# EAGLE design Driver_Shield (EAGLE 5.06)
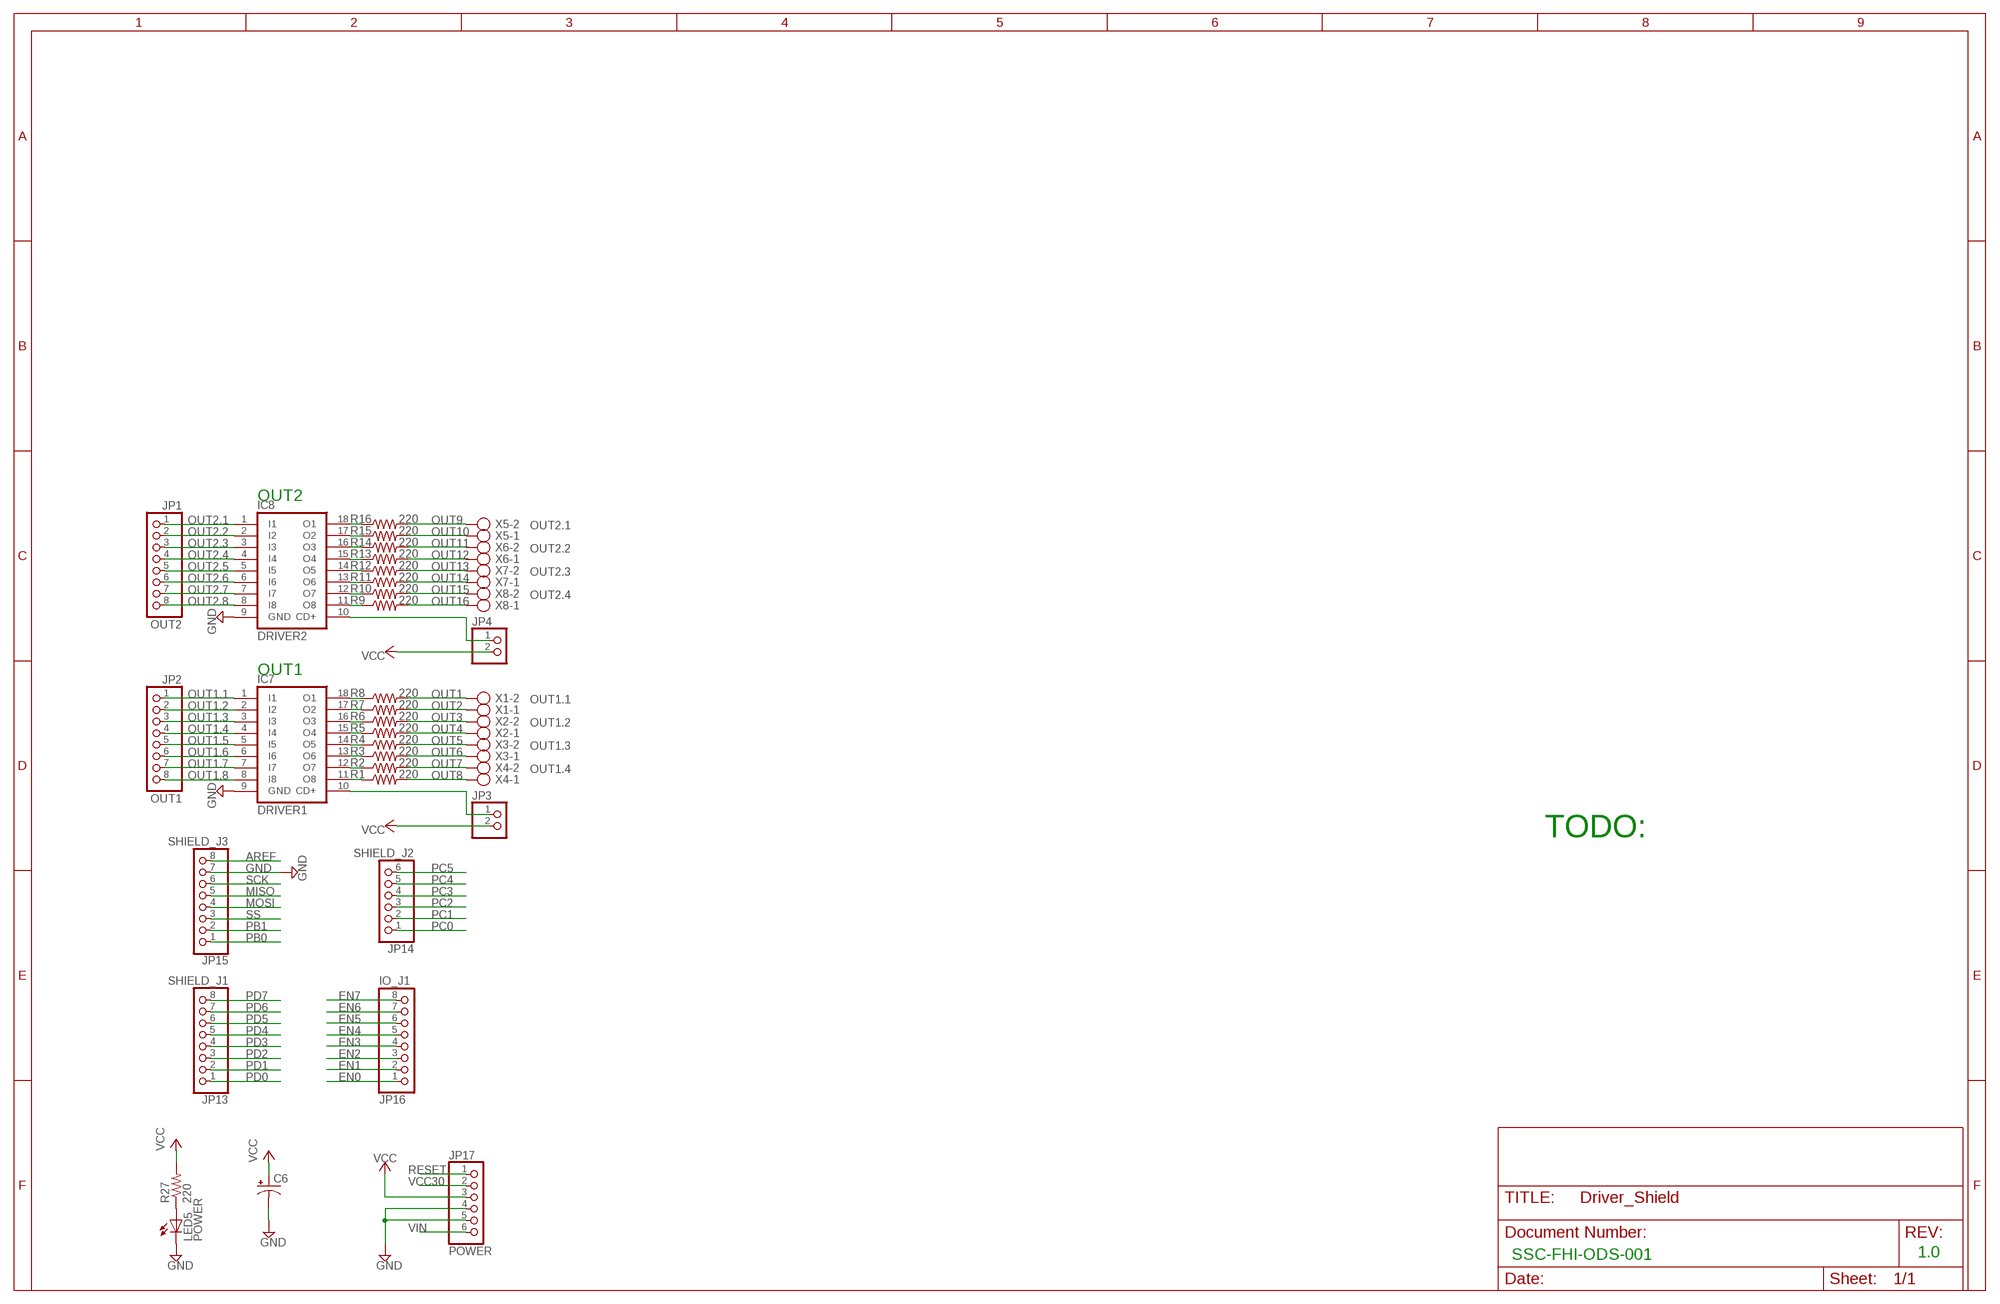
[diagram p0: schematic, sheet 1]

## Parts
C6  CPOL-USE2.5-5  [E2,5-5]
IC7  DRIVER1  ULN2803A  [DIL18]
IC8  DRIVER2  ULN2803A  [DIL18]
JP1  OUT2  PINHD-1X8  [1X08]
JP2  OUT1  PINHD-1X8  [1X08]
JP3  PINHD-1X2  [1X02]
JP4  PINHD-1X2  [1X02]
JP13  SHIELD_J1  PINHD-1X8  [1X08]
JP14  SHIELD_J2  PINHD-1X6  [1X06]
JP15  SHIELD_J3  PINHD-1X8  [1X08]
JP16  IO_J1  PINHD-1X8  [1X08]
JP17  POWER  PINHD-1X6  [1X06]
LED5  POWER  LED5MM  [LED5MM]
R1  220  R-US_0207/2V  [0207/2V]
R2  220  R-US_0207/2V  [0207/2V]
R3  220  R-US_0207/2V  [0207/2V]
R4  220  R-US_0207/2V  [0207/2V]
R5  220  R-US_0207/2V  [0207/2V]
R6  220  R-US_0207/2V  [0207/2V]
R7  220  R-US_0207/2V  [0207/2V]
R8  220  R-US_0207/2V  [0207/2V]
R9  220  R-US_0207/2V  [0207/2V]
R10  220  R-US_0207/2V  [0207/2V]
R11  220  R-US_0207/2V  [0207/2V]
R12  220  R-US_0207/2V  [0207/2V]
R13  220  R-US_0207/2V  [0207/2V]
R14  220  R-US_0207/2V  [0207/2V]
R15  220  R-US_0207/2V  [0207/2V]
R16  220  R-US_0207/2V  [0207/2V]
R27  220  R-US_0204/7  [0204/7]
X1  OUT1.1  AK550/2  [AK550/2]
X2  OUT1.2  AK550/2  [AK550/2]
X3  OUT1.3  AK550/2  [AK550/2]
X4  OUT1.4  AK550/2  [AK550/2]
X5  OUT2.1  AK550/2  [AK550/2]
X6  OUT2.2  AK550/2  [AK550/2]
X7  OUT2.3  AK550/2  [AK550/2]
X8  OUT2.4  AK550/2  [AK550/2]

## Nets
AREF: JP15.8
EN0: JP16.1
EN1: JP16.2
EN2: JP16.3
EN3: JP16.4
EN4: JP16.5
EN5: JP16.6
EN6: JP16.7
EN7: JP16.8
GND: C6.- IC7.9(GND) IC8.9(GND) JP15.7 JP17.4 JP17.5 LED5.K(C)
MISO: JP15.5
MOSI: JP15.4
N$4: IC7.12(O7) R2.1
N$12: IC7.18(O1) R8.1
N$13: IC7.17(O2) R7.1
N$14: IC7.16(O3) R6.1
N$15: IC7.15(O4) R5.1
N$17: IC8.12(O7) R10.1
N$21: IC7.14(O5) R4.1
N$30: IC7.13(O6) R3.1
N$32: IC7.11(O8) R1.1
N$39: LED5.A R27.1
N$61: IC8.18(O1) R16.1
N$62: IC8.17(O2) R15.1
N$63: IC8.16(O3) R14.1
N$64: IC8.15(O4) R13.1
N$65: IC8.14(O5) R12.1
N$66: IC8.13(O6) R11.1
N$68: IC8.11(O8) R9.1
OUT1: R8.2 X1.2
OUT1.1: IC7.1(I1) JP2.1
OUT1.2: IC7.2(I2) JP2.2
OUT1.3: IC7.3(I3) JP2.3
OUT1.4: IC7.4(I4) JP2.4
OUT1.5: IC7.5(I5) JP2.5
OUT1.6: IC7.6(I6) JP2.6
OUT1.7: IC7.7(I7) JP2.7
OUT1.8: IC7.8(I8) JP2.8
OUT1_FCB: IC7.10(CD+) JP3.1
OUT2: R7.2 X1.1
OUT2.1: IC8.1(I1) JP1.1
OUT2.2: IC8.2(I2) JP1.2
OUT2.3: IC8.3(I3) JP1.3
OUT2.4: IC8.4(I4) JP1.4
OUT2.5: IC8.5(I5) JP1.5
OUT2.6: IC8.6(I6) JP1.6
OUT2.7: IC8.7(I7) JP1.7
OUT2.8: IC8.8(I8) JP1.8
OUT2_FCB: IC8.10(CD+) JP4.1
OUT3: R6.2 X2.2
OUT4: R5.2 X2.1
OUT5: R4.2 X3.2
OUT6: R3.2 X3.1
OUT7: R2.2 X4.2
OUT8: R1.2 X4.1
OUT9: R16.2 X5.2
OUT10: R15.2 X5.1
OUT11: R14.2 X6.2
OUT12: R13.2 X6.1
OUT13: R12.2 X7.2
OUT14: R11.2 X7.1
OUT15: R10.2 X8.2
OUT16: R9.2 X8.1
PB0: JP15.1
PB1: JP15.2
PC0: JP14.1
PC1: JP14.2
PC2: JP14.3
PC3: JP14.4
PC4: JP14.5
PC5: JP14.6
PD0: JP13.1
PD1: JP13.2
PD2: JP13.3
PD3: JP13.4
PD4: JP13.5
PD5: JP13.6
PD6: JP13.7
PD7: JP13.8
RESET: JP17.1
SCK: JP15.6
SS: JP15.3
VCC: C6.+ JP3.2 JP4.2 JP17.3 R27.2
VCC30: JP17.2
VIN: JP17.6

## Notes on the sheet
- OUT2
- OUT1
- TODO:
- SSC-FHI-ODS-001 | 1.0

## Library data of the parts
C6 = rcl:CPOL-US: POLARIZED CAPACITOR, American symbol
IC7 IC8 = uln-udn:ULN2803A: DRIVER ARRAY
JP1 JP2 JP13 JP15 JP16 = pinhead:PINHD-1X8: PIN HEADER
JP3 JP4 = pinhead:PINHD-1X2: PIN HEADER
JP14 JP17 = pinhead:PINHD-1X6: PIN HEADER
LED5 = led:LED: LED OSRAM: - CHIPLED LG R971, LG N971, LY N971, LG Q971, LY Q971, LO R971, LY R971 LH N974, LH R974 LS Q976, LO Q976, LY Q976 LO Q996 - Hyper CHIPLED LW Q18S LB Q993, LB Q99A, LB R99A - SideLED LS A670, LO A670, LY A670, LG A670, LP A670 LB A673, LV A673, LT A673, LW A673 LH A674 LY A675 LS A676, LA A676, LO A676, LY A676, LW A676 LS A679, LY A679, LG A679 - Hyper Micro SIDELED® LS Y876, LA Y876, LO Y876, LY Y876 LT Y87S - SmartLED LW L88C, LW L88S LB L89C, LB L89S, LG L890 LS L89K, LO L89K, LY L89K LS L896, LA L896, LO L896, LY L896 - TOPLED LS T670, LO T670, LY T670, LG T670, LP T670 LSG T670, LSP T670, LSY T670, LOP T670, LYG T670 LG T671, LOG T671, LSG T671 LB T673, LV T673, LT T673, LW T673 LH T674 LS T676, LA T676, LO T676, LY T676, LB T676, LH T676, LSB T676, LW T676 LB T67C, LV T67C, LT T67C, LS T67K, LO T67K, LY T67K, LW E67C LS E67B, LA E67B, LO E67B, LY E67B, LB E67C, LV E67C, LT E67C LW T67C LS T679, LY T679, LG T679 LS T770, LO T770, LY T770, LG T770, LP T770 LB T773, LV T773, LT T773, LW T773 LH T774 LS E675, LA E675, LY E675, LS T675 LS T776, LA T776, LO T776, LY T776, LB T776 LHGB T686 LT T68C, LB T68C - Hyper Mini TOPLED® LB M676 - Mini TOPLED Santana® LG M470 LS M47K, LO M47K, LY M47K Source: http://www.osram.convergy.de - LUMILED® LXK2-PW12-R00, LXK2-PW12-S00, LXK2-PW14-U00, LXK2-PW14-V00 LXK2-PM12-R00, LXK2-PM12-S00, LXK2-PM14-U00 LXK2-PE12-Q00, LXK2-PE12-R00, LXK2-PE12-S00, LXK2-PE14-T00, LXK2-PE14-U00 LXK2-PB12-K00, LXK2-PB12-L00, LXK2-PB12-M00, LXK2-PB14-N00, LXK2-PB14-P00, LXK2-PB14-Q00 LXK2-PR12-L00, LXK2-PR12-M00, LXK2-PR14-Q00, LXK2-PR14-R00 LXK2-PD12-Q00, LXK2-PD12-R00, LXK2-PD12-S00 LXK2-PH12-R00, LXK2-PH12-S00 LXK2-PL12-P00, LXK2-PL12-Q00, LXK2-PL12-R00 Source: www.luxeon.com
R1-R16 R27 = resistor:R-US_: RESISTOR, American symbol
X1-X8 = con-ptr500+_v5:AK550/2: CONNECTOR

## Board
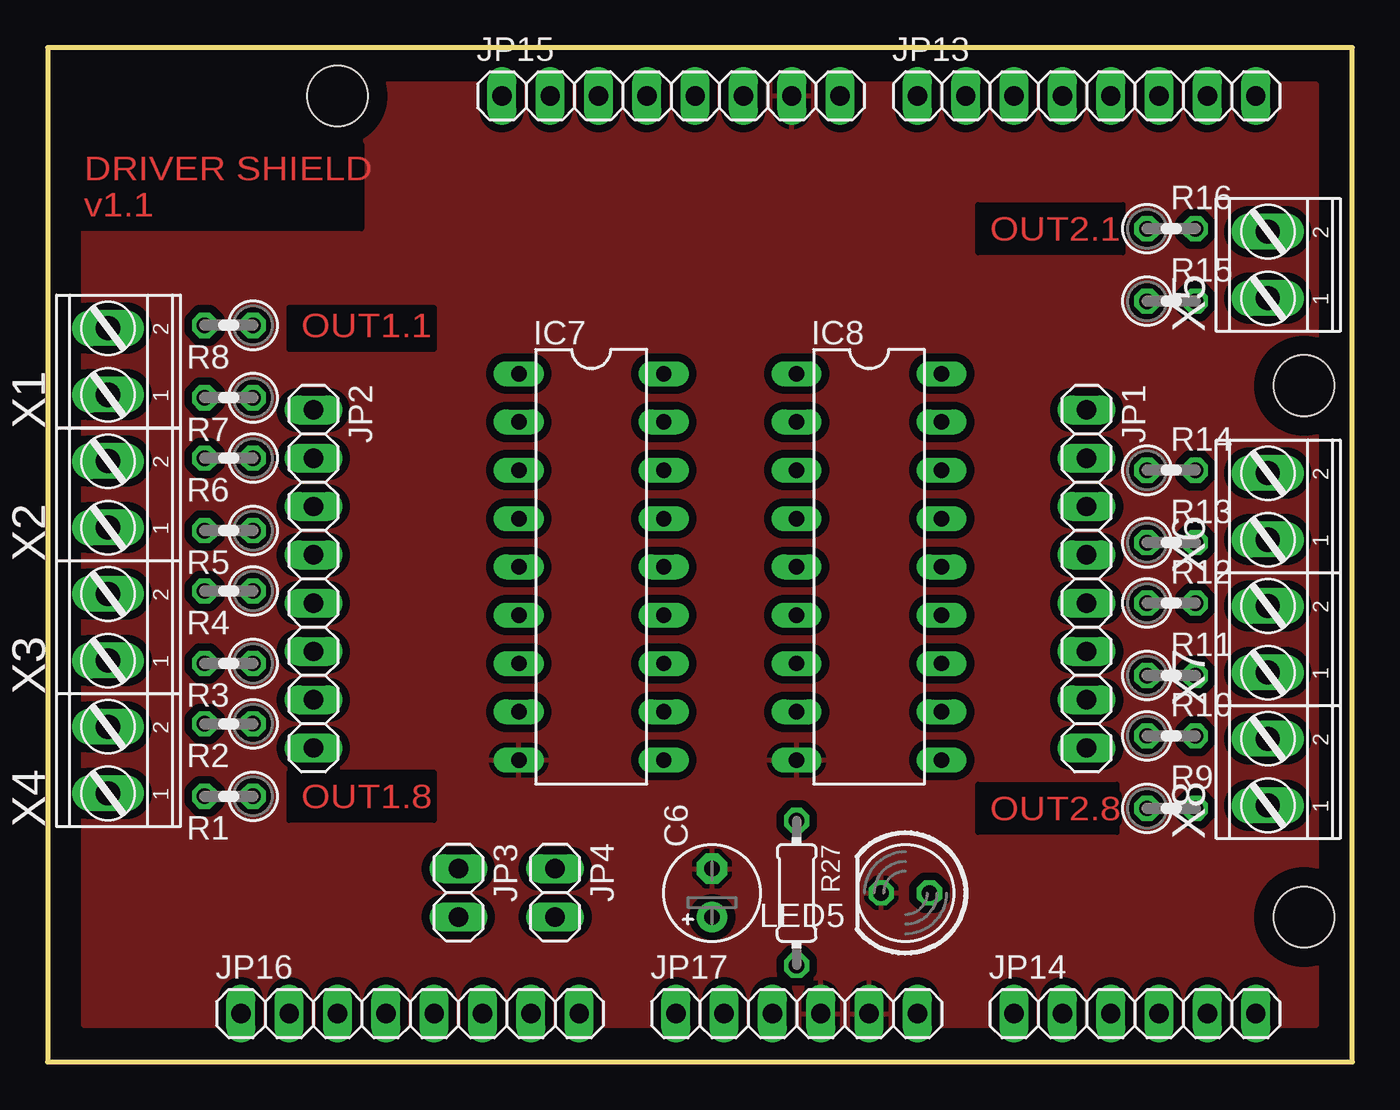
[diagram p1: board, top side]
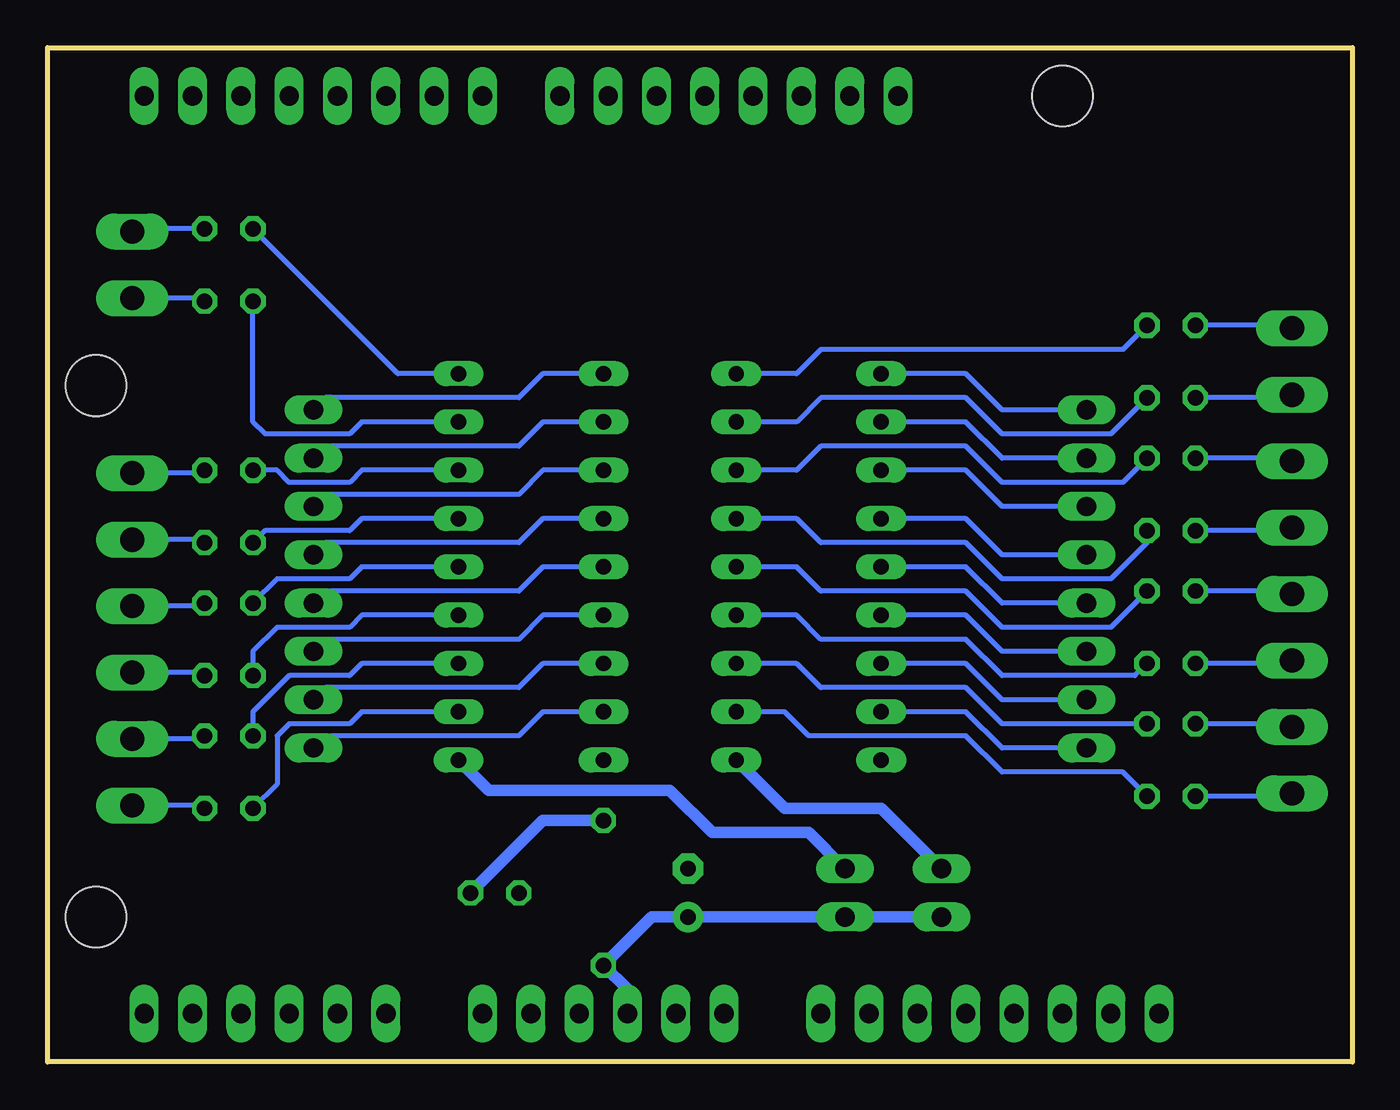
[diagram p2: board, bottom side, seen from below]

Size 68.58 x 53.34 mm. Coordinates in mm from the lower left corner, seen from the top.
Outline: 0,0 68.58,0 68.58,53.34 0,53.34 0,0
Copper layers (1*16): Top 0.035mm / dielectric 1.5mm / Bottom 0.035mm
Design rules "default *": minimum track width 8mil, minimum drill 24mil, track to track 16mil, track to pad 16mil, pad to pad 8mil, via to via 8mil, smd to smd 8mil, copper to edge 40mil, drill to drill 8mil, minimum pad ring 10mil, minimum via ring 8mil, stop-mask expansion 4mil, vias tented up to drill 0mil, thermal gap 10mil
Holes 3.2 mm at 66.04,35.56 66.04,7.62 15.24,50.8
tRestrict: area 12.7,37.5 to 20.3,39.7; area 48.9,42.5 to 56.5,45.1; area 48.9,12.1 to 56.2,14.6; area 12.7,12.7 to 20.3,15.2; area 0.6,43.8 to 16.5,48.3

### Footprints (pad centres in the part's own frame; a part is rotated, then mirrored left to right if it is on the bottom)
E2,5-5 = drill 0.813 pad 1.6 round: + -1.27,0 | drill 0.813 pad 1.6 octagon: - 1.27,0
DIL18 = drill 0.813 long: 1 -10.16,-3.81; 2 -7.62,-3.81; 3 -5.08,-3.81; 4 -2.54,-3.81; 5 0,-3.81; 6 2.54,-3.81; 7 5.08,-3.81; 8 7.62,-3.81; 9 10.16,-3.81; 10 10.16,3.81; 11 7.62,3.81; 12 5.08,3.81; 13 2.54,3.81; 14 0,3.81; 15 -2.54,3.81; 16 -5.08,3.81; 17 -7.62,3.81; 18 -10.16,3.81
1X08 = drill 1.016 long: 1 -8.89,0; 2 -6.35,0; 3 -3.81,0; 4 -1.27,0; 5 1.27,0; 6 3.81,0; 7 6.35,0; 8 8.89,0
1X02 = drill 1.016 long: 1 -1.27,0; 2 1.27,0
1X06 = drill 1.016 long: 1 -6.35,0; 2 -3.81,0; 3 -1.27,0; 4 1.27,0; 5 3.81,0; 6 6.35,0
LED5MM = drill 0.813 octagon: A -1.27,0; K 1.27,0
0207/2V = drill 0.813 octagon: 1 -1.27,0; 2 1.27,0
0204/7 = drill 0.813 octagon: 1 -3.81,0; 2 3.81,0
AK550/2 = drill 1.27 long: 1 -1.75,0; 2 1.75,0

### Placement (x,y rotation side)
C6  34.92,8.89 90 top
IC7  28.57,26.04 270 top
IC8  43.18,26.04 270 top
JP1  54.61,25.4 270 top
JP2  13.97,25.4 270 top
JP3  21.59,8.89 270 top
JP4  26.67,8.89 270 top
JP13  54.61,50.8 0 top
JP14  57.15,2.54 0 top
JP15  32.77,50.8 0 top
JP16  19.05,2.54 0 top
JP17  39.37,2.54 0 top
LED5  45.09,8.89 180 top
R1  9.53,13.97 180 top
R2  9.53,17.78 180 top
R3  9.53,20.95 180 top
R4  9.53,24.77 180 top
R5  9.53,27.94 180 top
R6  9.53,31.75 180 top
R7  9.53,34.92 180 top
R8  9.53,38.73 180 top
R9  59.05,13.34 0 top
R10  59.05,17.14 0 top
R11  59.05,20.32 0 top
R12  59.05,24.13 0 top
R13  59.05,27.3 0 top
R14  59.05,31.11 0 top
R15  59.05,40.01 0 top
R16  59.05,43.81 0 top
R27  39.37,8.89 270 top
X1  3.17,36.83 90 top
X2  3.17,29.84 90 top
X3  3.17,22.86 90 top
X4  3.17,15.88 90 top
X5  64.14,41.91 90 top
X6  64.14,29.21 90 top
X7  64.14,22.23 90 top
X8  64.14,15.24 90 top

### Tracks (layer width: path | path; a pad name or v marks a point on that pad's centre or on a via)
GND
  pour Top: 1.91,1.91 1.91,7.62 1.91,16.51 1.91,28.57 1.91,51.44 66.67,51.44 66.67,50.16 66.67,30.48 66.67,1.91
N$4
  Bottom 0.254: R2.1 18.41,17.78 20.32,19.68 27.94,19.68 29.21,20.95 IC7.12
N$12
  Bottom 0.254: R8.1 12.06,37.47 27.94,37.47 29.21,36.2 IC7.18
N$13
  Bottom 0.254: R7.1 12.7,33.02 18.41,33.02 20.32,34.92 27.94,34.92 29.21,33.66 IC7.17
N$14
  Bottom 0.254: R6.1 12.06,30.48 18.41,30.48 20.32,32.38 27.94,32.38 29.21,31.11 IC7.16
N$15
  Bottom 0.254: R5.1 10.79,27.3 12.7,25.4 18.41,25.4 20.32,27.3 27.94,27.3 29.21,28.57 IC7.15
N$17
  Bottom 0.254: IC8.12 52.07,20.95 52.7,20.32 55.88,20.32 57.78,18.41 R10.1
N$21
  Bottom 0.254: R4.1 12.7,22.86 18.41,22.86 20.32,24.77 27.94,24.77 29.21,26.04 IC7.14
N$30
  Bottom 0.254: R3.1 11.43,20.32 18.41,20.32 20.32,22.23 27.94,22.23 29.21,23.5 IC7.13
N$32
  Bottom 0.254: R1.1 12.06,15.24 18.41,15.24 20.32,17.14 28.57,17.14 29.84,18.41 IC7.11
N$39
  Bottom 0.61: R27.1 42.55,12.7 LED5.A
N$61
  Bottom 0.254: IC8.18 50.16,36.2 R16.1
N$62
  Bottom 0.254: IC8.17 52.07,33.66 52.7,33.02 57.15,33.02 57.78,33.66 R15.1
N$63
  Bottom 0.254: IC8.16 52.07,31.11 52.7,30.48 55.88,30.48 56.52,31.11 R14.1
N$64
  Bottom 0.254: IC8.15 52.07,28.57 52.7,27.94 57.15,27.94 R13.1
N$65
  Bottom 0.254: IC8.14 52.07,26.04 52.7,25.4 56.52,25.4 R12.1
N$66
  Bottom 0.254: IC8.13 52.07,23.5 52.7,22.86 56.52,22.86 57.78,21.59 R11.1
N$68
  Bottom 0.254: IC8.11 52.07,18.41 52.7,17.78 55.88,17.78 56.52,17.14 56.52,14.61 R9.1
OUT1
  Bottom 0.254: R8.2 3.33,38.73 X1.2
OUT1.1
  Bottom 0.254: JP2.1 18.41,34.29 20.32,36.2 IC7.1
OUT1.2
  Bottom 0.254: JP2.2 18.41,31.75 20.32,33.66 IC7.2
OUT1.3
  Bottom 0.254: JP2.3 18.41,29.21 20.32,31.11 IC7.3
OUT1.4
  Bottom 0.254: JP2.4 18.41,26.67 20.32,28.57 IC7.4
OUT1.5
  Bottom 0.254: JP2.5 18.41,24.13 20.32,26.04 IC7.5
OUT1.6
  Bottom 0.254: JP2.6 18.41,21.59 20.32,23.5 IC7.6
OUT1.7
  Bottom 0.254: JP2.7 18.41,19.05 20.32,20.95 IC7.7
OUT1.8
  Bottom 0.254: JP2.8 18.41,16.51 20.32,18.41 IC7.8
OUT1_FCB
  Bottom 0.61: JP3.1 24.77,13.34 29.84,13.34 IC7.10
OUT2
  Bottom 0.254: R7.2 3.33,34.92 X1.1
OUT2.1
  Bottom 0.254: IC8.1 42.55,36.2 43.81,34.92 53.98,34.92 JP1.1
OUT2.2
  Bottom 0.254: IC8.2 42.55,33.66 43.81,32.38 53.98,32.38 JP1.2
OUT2.3
  Bottom 0.254: IC8.3 42.55,31.11 43.81,29.84 53.98,29.84 JP1.3
OUT2.4
  Bottom 0.254: IC8.4 42.55,28.57 43.81,27.3 53.98,27.3 JP1.4
OUT2.5
  Bottom 0.254: IC8.5 42.55,26.04 43.81,24.77 53.98,24.77 JP1.5
OUT2.6
  Bottom 0.254: IC8.6 42.55,23.5 43.81,22.23 53.98,22.23 JP1.6
OUT2.7
  Bottom 0.254: IC8.7 42.55,20.95 43.81,19.68 53.98,19.68 JP1.7
OUT2.8
  Bottom 0.254: IC8.8 42.55,18.41 43.81,17.14 53.98,17.14 JP1.8
OUT2_FCB
  Bottom 0.61: JP4.1 28.57,12.06 33.66,12.06 35.88,14.29 45.4,14.29 IC8.10
OUT3
  Bottom 0.254: R6.2 3.33,31.75 X2.2
OUT4
  Bottom 0.254: R5.2 3.33,27.94 X2.1
OUT5
  Bottom 0.254: R4.2 3.33,24.77 X3.2
OUT6
  Bottom 0.254: R3.2 3.33,20.95 X3.1
OUT7
  Bottom 0.254: R2.2 3.33,17.78 X4.2
OUT8
  Bottom 0.254: R1.2 3.33,13.97 X4.1
OUT9
  Bottom 0.254: R16.2 63.98,43.81 X5.2
OUT10
  Bottom 0.254: X5.1 60.48,40.16 R15.2
OUT11
  Bottom 0.254: X6.2 60.48,30.96 R14.2
OUT12
  Bottom 0.254: X6.1 60.48,27.46 R13.2
OUT13
  Bottom 0.254: X7.2 60.48,23.98 R12.2
OUT14
  Bottom 0.254: X7.1 60.48,20.48 R11.2
OUT15
  Bottom 0.254: X8.2 60.48,16.99 R10.2
OUT16
  Bottom 0.254: X8.1 60.48,13.49 R9.2
VCC
  Bottom 0.61: JP17.3 38.1,3.81 R27.2 36.83,7.62 C6.+ JP4.2 JP3.2

### Text on the board
Top: DRIVER SHIELD | v1.1 | OUT2.1 | OUT1.1 | OUT1.8 | OUT2.8